# Altium project air quality monitor add esp32 chip.PrjPcb
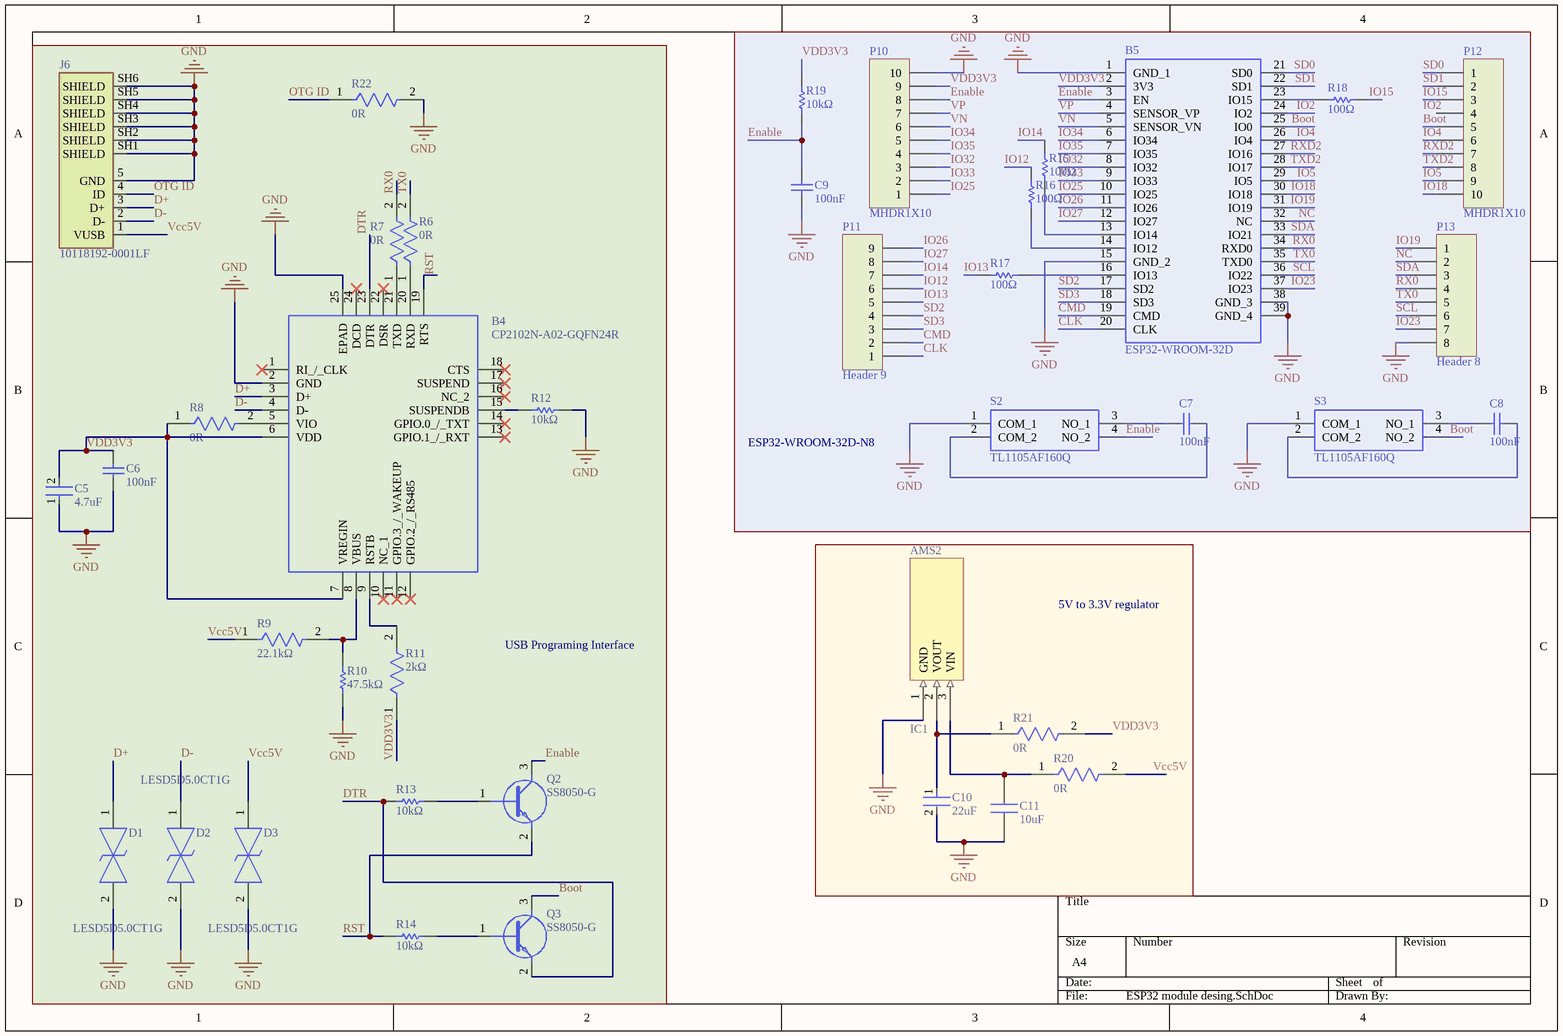
[diagram p0: ESP32 module desing.SchDoc]
1 sheet, 39 parts. Net scope: global (net labels, ports and power ports of the same name join across sheets).
Board file: air qulity monitor add esp32 chip.PcbDoc

## Sheet ESP32 module desing.SchDoc
size A4

### Parts
AMS2  IC1  [SOT89-150P350X150-3N]
B4  CP2102N-A02-GQFN24R  [QFN50P400X400X80-25N-D]
B5  ESP32-WROOM-32D  [ESP32WROOM32D]
C5  4.7uF  [FP-CL21-IPC_A]
C6  100nF  [CAPC1050X55X23ML05T13]
C7  100nF  [CAPC1050X55X23ML05T13]
C8  100nF  [CAPC1050X55X23ML05T13]
C9  100nF  [CAPC1050X55X23ML05T13]
C10  22uF  [FP-GRM219-0_2-0_15-IPC_A]
C11  10uF  [CAPC1005X70N]
D1  LESD5D5.0CT1G  [LESD5D50CT1G]
D2  LESD5D5.0CT1G  [LESD5D50CT1G]
D3  LESD5D5.0CT1G  [LESD5D50CT1G]
J6  10118192-0001LF  [AMPHENOL_10118192-0001LF]
P10  MHDR1X10  [MHDR1X10]
P11  Header 9  [HDR1X9]
P12  MHDR1X10  [MHDR1X10]
P13  Header 8  [HDR1X8]
Q2  SS8050-G  [SOT95P240X115-3N]
Q3  SS8050-G  [SOT95P240X115-3N]
R6  0R  [FP-RC0402-0_4-IPC_A]
R7  0R  [FP-RC0402-0_4-IPC_A]
R8  0R  [FP-RC0402-0_4-IPC_A]
R9  22.1kΩ  [FP-RC0402-0_4-IPC_B]
R10  47.5kΩ  [RESC1005X40X25NL05T10]
R11  2kΩ  [FP-RC_L0402-MFG]
R12  10kΩ  [RESC1005X40X25LL05T10]
R13  10kΩ  [RESC1005X40X25LL05T10]
R14  10kΩ  [RESC1005X40X25LL05T10]
R15  100Ω  [RESC1005X40X25ML05T10]
R16  100Ω  [RESC1005X40X25ML05T10]
R17  100Ω  [RESC1005X40X25ML05T10]
R18  100Ω  [RESC1005X40X25ML05T10]
R19  10kΩ  [RESC1005X40X25LL05T10]
R20  0R  [FP-RC0402-0_4-IPC_A]
R21  0R  [FP-RC0402-0_4-IPC_A]
R22  0R  [FP-RC0402-0_4-IPC_A]
S2  TL1105AF160Q  [TL1105AF160Q]
S3  TL1105AF160Q  [TL1105AF160Q]

### Blocks framed on the sheet
USB Programing Interface: B4 C5 C6 D1-D3 J6 Q2 Q3 R6-R14 R22
ESP32-WROOM-32D-N8: B5 C7-C9 P10-P13 R15-R19 S2 S3
5V to 3.3V regulator: AMS2 C10 C11 R20 R21

### Nets
GND: AMS2.1(GND) B4.2(GND) B4.25(EPAD) B5.1(GND_1) B5.15(GND_2) B5.38(GND_3) B5.39(GND_4) C5.1 C6.1 C9.2 C10.2 C11.1 D1.2 D2.2 D3.2 J6.5(GND) J6.SH1(SHIELD) J6.SH2(SHIELD) J6.SH3(SHIELD) J6.SH4(SHIELD) J6.SH5(SHIELD) J6.SH6(SHIELD) P10.10 P13.8 R10.1 R12.2 R22.2 S2.1(COM_1) S3.1(COM_1)
Boot: B5.25(IO0) P12.5 Q3.3(C) S3.4(NO_2)
CLK: B5.20(CLK) P11.1
CMD: B5.19(CMD) P11.2
D+: B4.3(D+) D1.1 J6.3(D+)
D-: B4.4(D-) D2.1 J6.2(D-)
DTR: B4.23(DTR) Q3.2(E) R13.1
Enable: B5.3(EN) C9.1 P10.8 Q2.3(C) R19.1 S2.4(NO_2)
IO2: B5.24(IO2)
IO4: B5.26(IO4) P12.6
IO5: B5.29(IO5) P12.9
IO12: P11.6 R16.2
IO13: P11.5 R17.1
IO14: P11.7 R15.2
IO15: P12.3 R18.2
IO18: B5.30(IO18) P12.10
IO19: B5.31(IO19) P13.1
IO23: B5.37(IO23) P13.7
IO25: B5.10(IO25) P10.1
IO26: B5.11(IO26) P11.9
IO27: B5.12(IO27) P11.8
IO32: B5.8(IO32) P10.3
IO33: B5.9(IO33) P10.2
IO34: B5.6(IO34) P10.5
IO35: B5.7(IO35) P10.4
NC: B5.32(NC) P13.2
OTG ID: J6.4(ID) R22.1
RST: B4.19(RTS) Q2.2(E) R14.1
RX0: B5.34(RXD0) P13.4 R7.2
RXD2: B5.27(IO16) P12.7
SCL: B5.36(IO22) P13.6
SD0: B5.21(SD0) P12.1
SD1: B5.22(SD1) P12.2
SD2: B5.17(SD2) P11.4
SD3: B5.18(SD3) P11.3
SDA: B5.33(IO21) P13.3
TX0: B5.35(TXD0) P13.5 R6.2
TXD2: B5.28(IO17) P12.8
Vcc5V: D3.1 J6.1(VUSB) R9.1 R20.2
VDD3V3: B4.6(VDD) B4.7(VREGIN) B5.2(3V3) C5.2 C6.2 P10.9 R8.1 R11.1 R19.2 R21.2
VN: B5.5(SENSOR_VN) P10.6
VP: B5.4(SENSOR_VP) P10.7
NetAMS2_2: AMS2.2(VOUT) C10.1 R21.1
NetAMS2_3: AMS2.3(VIN) C11.2 R20.1
NetB4_5: B4.5(VIO) R8.2
NetB4_8: B4.8(VBUS) R9.2 R10.2
NetB4_9: B4.9(RSTB) R11.2
NetB4_15: B4.15(SUSPENDB) R12.1
NetB4_20: B4.20(RXD) R6.1
NetB4_21: B4.21(TXD) R7.1
NetB5_13: B5.13(IO14) R15.1
NetB5_14: B5.14(IO12) R16.1
NetB5_16: B5.16(IO13) R17.2
NetB5_23: B5.23(IO15) R18.1
NetC7_1: C7.1 S2.2(COM_2)
NetC7_2: C7.2 S2.3(NO_1)
NetC8_1: C8.1 S3.2(COM_2)
NetC8_2: C8.2 S3.3(NO_1)
NetQ2_1: Q2.1(B) R13.2
NetQ3_1: Q3.1(B) R14.2

Not connected (* = marked no-connect by the designer): B4 1(RI_/_CLK)* 10(NC_1)* 11(GPIO.3_/_WAKEUP)* 12(GPIO.2_/_RS485)* 13(GPIO.1_/_RXT)* 14(GPIO.0_/_TXT)* 16(NC_2)* 17(SUSPEND)* 18(CTS)* 22(DSR)* 24(DCD)*; P12 4

### Notes on the sheet
- Labels drawn without touching a wire or pin: IO2

### Library data of the parts
AMS2 = IC?: 75dB@(120Hz) 1A 1.25V@(1A) ±125℃@(Tj) Fixed 3.3V~3.3V Positive 1 20V SOT-89 Linear Voltage Regulators (LDO) ROHS; Manufacturer: YONGYUTAI; Mfr. Part #: AMS1117-3.3; LCSC Part #: C2904742; Package: SOT-89; Datasheet: https://datasheet.lcsc.com/lcsc/2110121330_YONGYUTAI-AMS1117-3-3_C2904742.pdf
B4 = CP2102N-A02-GQFN24R: USB Interface IC USB to UART bridge - QFN24; Manufacturer: SILICON LABS; Mfr.Part #: CP2102N-A02-GQFN24R; LCSC Part#: C969151; Datasheet: https://datasheet.lcsc.com/lcsc/2201131400_SILICON-LABS-CP2102N-A02-GQFN24R_C969151.pdf; Package: QFN-24-EP(4x4)
B5 = ESP32-WROOM-32D: WiFi Modules (802.11) SMD Module, ESP32-D0WD, 32Mbits SPI flash, UART mode, PCB antenna; Manufacturer_Name: Espressif Systems; Geometry.Height: 3.1mm; Manufacturer_Part_Number: ESP32-WROOM-32D; Mouser Part Number: N/A; Mouser Price/Stock: https://www.mouser.co.uk/ProductDetail/Espressif-Systems/ESP32-WROOM-32D?qs=MLItCLRbWszx2KabkKPu5A%3D%3D; Arrow Part Number: *; Arrow Price/Stock: *; Mouser Testing Part Number: *; Mouser Testing Price/Stock: *; Datasheet Link: https://www.mouser.com/datasheet/2/891/esp32-wroom-32d_esp32-wroom-32u_datasheet_en-1365844.pdf
C5 = CMP-13271-002624-1: X5R 25V 4.7uF ±10% 0805 Multilayer Ceramic Capacitors MLCC - SMD/SMT ROHS; Mfr.Part #: CL21A475KAQNNNE; Manufacturer: Samsung Electro-Mechanics; LCSC Part#: C1779; Value: 4.7uF; Package: 0805; Datasheet: https://datasheet.lcsc.com/lcsc/1810261822_Samsung-Electro-Mechanics-CL21A475KAQNNNE_C1779.pdf
C6-C9 = CMP-2000-05439-1: X7R 100nF 16V ±10% 0402 Multilayer Ceramic Capacitors MLCC - SMD/SMT ROHS; Manufacturer: Samsung Electro-Mechanics; Mfr.Part #: CL05B104KO5NNNC; Package: 0402; Value: 100nF; Datasheet: https://datasheet.lcsc.com/lcsc/1810191219_Samsung-Electro-Mechanics-CL05B104KO5NNNC_C1525.pdf; LCSC Part#: C1525
C10 = CMP-06035-056251-1: Chip Multilayer Ceramic Capacitors for General Purpose, 0805, 22uF, X5R, 15%, 20%, 16V; Mfr. Part #: GRM219R61C226ME15L; Manufacturer: Murata Electronics; value: 22uF; Datasheet: https://datasheet.lcsc.com/lcsc/1811141821_Murata-Electronics-GRM219R61C226ME15L_C162295.pdf; LCSC Part #: C162295; Package: 0805
C11 = CL05A106MQ5NUNC: 6.3V 10uF X5R ±20% 0402 Multilayer Ceramic Capacitors MLCC - SMD/SMT ROHS; Manufacturer: Samsung Electro-Mechanics; Mfr. Part #: CL05A106MQ5NUNC; LCSC Part #: C15525; value: 10uF; Datasheet Link: https://datasheet.datasheetarchive.com/originals/distributors/Datasheets-DGA10/2406160.pdf; Package: 0402
D1-D3 = LESD5D5.0CT1G: Transient Voltage Suppressors for ESD Protection; Manufacturer: UMW(Youtai Semiconductor Co., Ltd.); Mfr.Part #: LESD5D5.0CT1G; Datasheet: https://datasheet.lcsc.com/lcsc/2210171730_UMW-Youtai-Semiconductor-Co---Ltd--LESD5D5-0CT1G_C5199850.pdf; Package: SOD-523; LCSC Part#: C5199850
J6 = 10118192-0001LF: Single Port 5 Contact Horizontal Right Angle Shielded Micro B USB 2.0 Connector; Manufacturer: Amphenol ICC; Mfr.Part #: 10118192-0001LF; Package: SMD; LCSC Part#: C132564; Datasheet: https://datasheet.lcsc.com/lcsc/2111290930_Amphenol-ICC-10118192-0001LF_C132564.pdf
P10 P12 = MHDR1X10: Header, 10-Pin; LatestRevisionDate: 17-Jul-2002; LatestRevisionNote: Re-released for DXP Platform.; Publisher: Altium Limited
P11 = Header 9: Header, 9-Pin; LatestRevisionDate: 17-Jul-2002; LatestRevisionNote: Re-released for DXP Platform.; Publisher: Altium Limited
P13 = Header 8: Header, 8-Pin; LatestRevisionDate: 17-Jul-2002; LatestRevisionNote: Re-released for DXP Platform.; Publisher: Altium Limited
Q2 Q3 = SS8050-G: 100nA 25V 300mW 200@100mA,1V 1.5A 100MHz 500mV@800mA,80mA NPN +150℃@(Tj) SOT-23 Bipolar Transistors - BJT ROHS; Manufacturer: Jiangsu Changjing Electronics Technology Co., Ltd.; LCSC Part#: C164885; Package: SOT-23; Mfr.Part #: SS8050-G; Datasheet: https://datasheet.lcsc.com/lcsc/1809211025_Jiangsu-Changjing-Electronics-Technology-Co---Ltd--SS8050-G_C164885.pdf
R6-R8 R20-R22 = CMP-2002-07342-2: RES SMD 0 OHM JUMPER 1/16W 0402; Manufacturer: Yageo; Mfr. Part #: RC0402FR-070RL; value: 0R; Package: 0402; LCSC Part #: C106231; Datasheet: https://www.lcsc.com/product-detail/Chip-Resistor-Surface-Mount_YAGEO-RC0402FR-070RL_C106231.html
R9 = CMP-2002-07515-2: RES 22.1K OHM 1% 1/16W 0402; Manufacturer: YAGEO; Mfr.Part #: RC0402FR-0722K1L; Datasheet: https://datasheet.lcsc.com/lcsc/1810241338_YAGEO-RC0402FR-0722K1L_C163478.pdf; LCSC Part#: C163478; Package: 0402; Value: 22.1kΩ
R10 = CMP-1011-00700-2: Mfr.Part #: RC0402FR-0747K5L; Manufacturer: YAGEO; LCSC Part#: C137974; Package: 0402; Datasheet: https://datasheet.lcsc.com/lcsc/1810241332_YAGEO-RC0402FR-0747K5L_C137974.pdf; Value: 47.5kΩ
R11 = CMP-2002-07580-2: 62.5mW Thick Film Resistors 50V ±100ppm/℃ ±1% -55℃~+155℃ 2kΩ 0402 Chip Resistor - Surface Mount ROHS; Manufacturer: YAGEO; Mfr.Part #: RESC10050X35; LCSC Part#: C60488; Package: 0402; ComponentLink2Description: Datasheet; ComponentLink2URL: http://www.yageo.com/documents/recent/PYu-RC_Group_51_RoHS_L_9.pdf; Value: 2kΩ
R12-R14 R19 = CMP-2002-07353-1: 50V 10kΩ Thick Film Resistors 62.5mW ±1% -55℃~+155℃ ±100ppm/℃ 0402 Chip Resistor - Surface Mount ROHS; Mfr.Part #: RC0402FR-0710KL; Manufacturer: YAGEO; Value: 10kΩ; LCSC Part#: C60490; Package: 0402
R15-R18 = CMP-2002-07344-1: 100Ω 62.5mW 50V ±1% -55℃~+155℃ ±100ppm/℃ 0402 Chip Resistor - Surface Mount ROHS; Mfr.Part #: RC0402FR-07100RL; Manufacturer: YAGEO; Value: 100Ω; LCSC Part#: C2935235; Package: 0402; Datasheet: https://datasheet.lcsc.com/lcsc/2201121700_YAGEO-RC0402FR-07100RL_C2935235.pdf
S2 S3 = TL1105AF160Q: 6mm 1.4mm Round Button 50mA Straight 6mm SPST 12V Plugin,6x6mm Tactile Switches ROHS; Manufacturer: E-Switch; Mfr.Part #: TL1105AF160Q; Package: Plugin,6x6mm; LCSC Part#: C273465; Datasheet: https://datasheet.lcsc.com/lcsc/1809291031_E-Switch-TL1105AF160Q_C273465.pdf